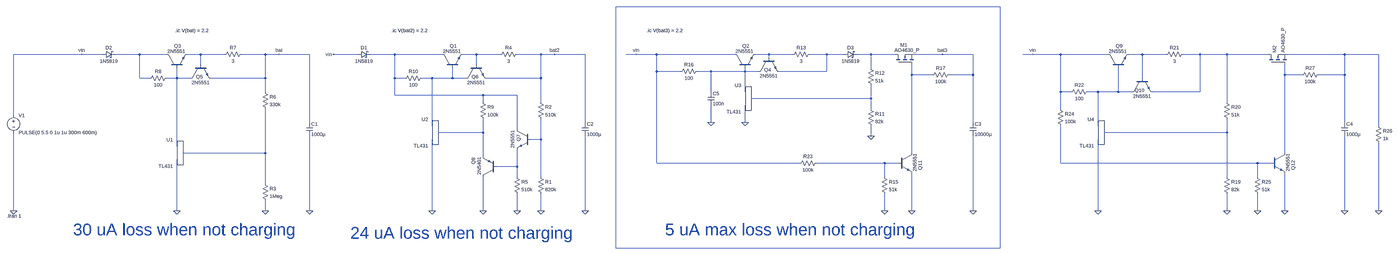
[diagram p0: schematic discrete_charger_TL431.asc, whole sheet]
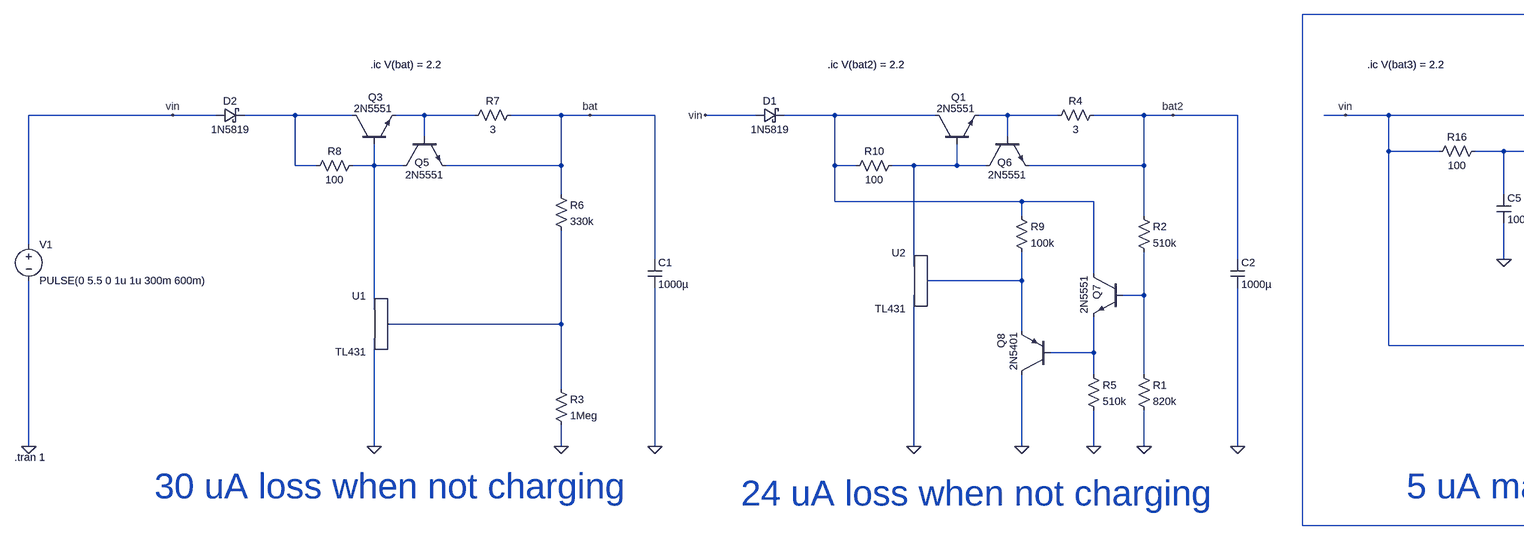
[diagram p1: schematic discrete_charger_TL431.asc, part, row 1 of 1, column 1 of 2]
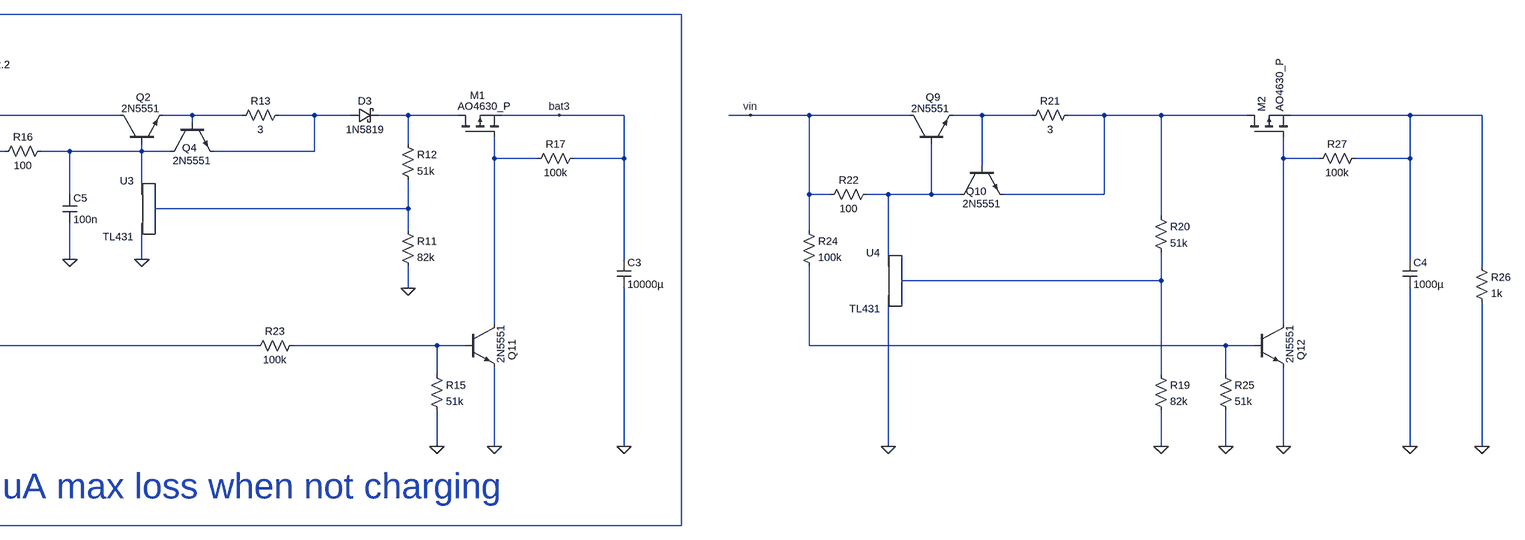
[diagram p2: schematic discrete_charger_TL431.asc, part, row 1 of 1, column 2 of 2]
discrete_charger_TL431.asc, the LTspice schematic file:
Version 4
SHEET 1 6228 756
WIRE 4224 -384 2416 -384
WIRE -96 -160 -416 -160
WIRE 0 -160 -96 -160
WIRE 176 -160 64 -160
WIRE 304 -160 176 -160
WIRE 464 -160 400 -160
WIRE 576 -160 464 -160
WIRE 768 -160 656 -160
WIRE 832 -160 768 -160
WIRE 976 -160 832 -160
WIRE 1200 -160 1088 -160
WIRE 1376 -160 1264 -160
WIRE 1600 -160 1376 -160
WIRE 1760 -160 1696 -160
WIRE 1872 -160 1760 -160
WIRE 2064 -160 1952 -160
WIRE 2128 -160 2064 -160
WIRE 2272 -160 2128 -160
WIRE 2512 -160 2464 -160
WIRE 2608 -160 2512 -160
WIRE 2976 -160 2608 -160
WIRE 3136 -160 3072 -160
WIRE 3248 -160 3136 -160
WIRE 3408 -160 3328 -160
WIRE 3488 -160 3408 -160
WIRE 3616 -160 3552 -160
WIRE 3728 -160 3616 -160
WIRE 3952 -160 3824 -160
WIRE 4096 -160 3952 -160
WIRE 4432 -160 4384 -160
WIRE 4656 -160 4432 -160
WIRE 4880 -160 4656 -160
WIRE 5040 -160 4976 -160
WIRE 5152 -160 5040 -160
WIRE 5312 -160 5232 -160
WIRE 5440 -160 5312 -160
WIRE 5632 -160 5440 -160
WIRE 6000 -160 5728 -160
WIRE 6160 -160 6000 -160
WIRE 3136 -144 3136 -160
WIRE 464 -112 464 -160
WIRE 1760 -112 1760 -160
WIRE 3616 -96 3616 -160
WIRE 2608 -80 2608 -160
WIRE 2720 -80 2608 -80
WIRE 2864 -80 2800 -80
WIRE 3024 -80 3024 -96
WIRE 3024 -80 2864 -80
WIRE 3088 -80 3024 -80
WIRE 3408 -80 3408 -160
WIRE 3408 -80 3184 -80
WIRE 3808 -64 3808 -112
WIRE 3904 -64 3808 -64
WIRE 4096 -64 4096 -160
WIRE 4096 -64 3984 -64
WIRE 5712 -64 5712 -112
WIRE 5792 -64 5712 -64
WIRE 6000 -64 6000 -160
WIRE 6000 -64 5872 -64
WIRE 176 -48 176 -160
WIRE 224 -48 176 -48
WIRE 352 -48 352 -96
WIRE 352 -48 304 -48
WIRE 416 -48 352 -48
WIRE 768 -48 768 -160
WIRE 768 -48 512 -48
WIRE 1376 -48 1376 -160
WIRE 1424 -48 1376 -48
WIRE 1552 -48 1504 -48
WIRE 1648 -48 1648 -96
WIRE 1648 -48 1552 -48
WIRE 1712 -48 1648 -48
WIRE 2064 -48 2064 -160
WIRE 2064 -48 1808 -48
WIRE 5040 -48 5040 -160
WIRE 768 16 768 -48
WIRE 2864 16 2864 -80
WIRE 3024 16 3024 -80
WIRE 4656 16 4656 -160
WIRE 4704 16 4656 16
WIRE 4832 16 4784 16
WIRE 4928 16 4928 -96
WIRE 4928 16 4832 16
WIRE 4992 16 4928 16
WIRE 5312 16 5312 -160
WIRE 5312 16 5088 16
WIRE 1376 32 1376 -48
WIRE 1792 32 1376 32
WIRE 1952 32 1792 32
WIRE 3616 48 3616 -16
WIRE 3616 48 3056 48
WIRE 1792 64 1792 32
WIRE 2064 64 2064 -48
WIRE 5440 64 5440 -160
WIRE 3616 96 3616 48
WIRE 4656 96 4656 16
WIRE -416 128 -416 -160
WIRE 976 160 976 -160
WIRE 2272 160 2272 -160
WIRE 2864 160 2864 80
WIRE 3024 160 3024 80
WIRE 4096 160 4096 -64
WIRE 6000 160 6000 -64
WIRE 1552 176 1552 -48
WIRE 4832 176 4832 16
WIRE 6160 176 6160 -160
WIRE 1952 192 1952 32
WIRE 1792 208 1792 144
WIRE 1792 208 1584 208
WIRE 5440 208 5440 144
WIRE 5440 208 4864 208
WIRE 3616 224 3616 176
WIRE 2064 240 2064 144
WIRE 2064 240 2016 240
WIRE 352 272 352 -48
WIRE 768 304 768 96
WIRE 768 304 384 304
WIRE 3808 304 3808 -64
WIRE 5712 304 5712 -64
WIRE 1792 320 1792 208
WIRE 2608 352 2608 -80
WIRE 3280 352 2608 352
WIRE 3680 352 3360 352
WIRE 3744 352 3680 352
WIRE 4656 352 4656 176
WIRE 5584 352 4656 352
WIRE 5648 352 5584 352
WIRE 1952 368 1952 288
WIRE 1952 368 1856 368
WIRE 1952 416 1952 368
WIRE 2064 416 2064 240
WIRE 3680 416 3680 352
WIRE 5440 416 5440 208
WIRE 5584 416 5584 352
WIRE 768 448 768 304
WIRE -416 576 -416 208
WIRE 352 576 352 336
WIRE 768 576 768 528
WIRE 976 576 976 224
WIRE 1552 576 1552 240
WIRE 1792 576 1792 416
WIRE 1952 576 1952 496
WIRE 2064 576 2064 496
WIRE 2272 576 2272 224
WIRE 3680 576 3680 496
WIRE 3808 576 3808 400
WIRE 4096 576 4096 224
WIRE 4832 576 4832 240
WIRE 5440 576 5440 496
WIRE 5584 576 5584 496
WIRE 5712 576 5712 400
WIRE 6000 576 6000 224
WIRE 6160 576 6160 256
WIRE 2416 752 2416 -384
WIRE 4224 752 4224 -384
WIRE 4224 752 2416 752
FLAG 768 576 0
FLAG 976 576 0
FLAG -416 576 0
FLAG 832 -160 bat
FLAG 352 576 0
FLAG -96 -160 vin
FLAG 2064 576 0
FLAG 2272 576 0
FLAG 2128 -160 bat2
FLAG 1552 576 0
FLAG 1088 -160 vin
FLAG 1952 576 0
FLAG 1792 576 0
FLAG 3616 224 0
FLAG 4096 576 0
FLAG 3952 -160 bat3
FLAG 3024 160 0
FLAG 2512 -160 vin
FLAG 3680 576 0
FLAG 3808 576 0
FLAG 5440 576 0
FLAG 6000 576 0
FLAG 4832 576 0
FLAG 4432 -160 vin
FLAG 5584 576 0
FLAG 5712 576 0
FLAG 6160 576 0
FLAG 2864 160 0
SYMBOL res 752 432 R0
SYMATTR InstName R3
SYMATTR Value 1Meg
SYMBOL npn 304 -96 R270
WINDOW 0 104 35 VRight 2
WINDOW 3 79 3 VRight 2
SYMATTR InstName Q3
SYMATTR Value 2N5551
SYMBOL res 752 0 R0
SYMATTR InstName R6
SYMATTR Value 330k
SYMBOL voltage -416 112 R0
WINDOW 123 0 0 Left 0
WINDOW 39 0 0 Left 0
SYMATTR InstName V1
SYMATTR Value PULSE(0 5.5 0 1u 1u 300m 600m)
SYMBOL cap 960 160 R0
SYMATTR InstName C1
SYMATTR Value 1000µ
SYMBOL res 560 -144 R270
WINDOW 0 32 56 VTop 2
WINDOW 3 0 56 VBottom 2
SYMATTR InstName R7
SYMATTR Value 3
SYMBOL npn 416 -112 M90
WINDOW 0 57 58 VLeft 2
WINDOW 3 85 90 VLeft 2
SYMATTR InstName Q5
SYMATTR Value 2N5551
SYMBOL ZZZ\\REF\\TL431 368 272 M0
SYMATTR InstName U1
SYMBOL res 2048 400 R0
SYMATTR InstName R1
SYMATTR Value 820k
SYMBOL npn 1600 -96 R270
WINDOW 0 104 35 VRight 2
WINDOW 3 79 3 VRight 2
SYMATTR InstName Q1
SYMATTR Value 2N5551
SYMBOL res 2048 48 R0
SYMATTR InstName R2
SYMATTR Value 510k
SYMBOL cap 2256 160 R0
SYMATTR InstName C2
SYMATTR Value 1000µ
SYMBOL res 1856 -144 R270
WINDOW 0 32 56 VTop 2
WINDOW 3 0 56 VBottom 2
SYMATTR InstName R4
SYMATTR Value 3
SYMBOL npn 1712 -112 M90
WINDOW 0 57 58 VLeft 2
WINDOW 3 85 90 VLeft 2
SYMATTR InstName Q6
SYMATTR Value 2N5551
SYMBOL ZZZ\\REF\\TL431 1568 176 M0
SYMATTR InstName U2
SYMBOL npn 2016 192 M0
WINDOW 0 57 58 VLeft 2
WINDOW 3 85 90 VLeft 2
SYMATTR InstName Q7
SYMATTR Value 2N5551
SYMBOL res 1936 400 R0
SYMATTR InstName R5
SYMATTR Value 510k
SYMBOL pnp 1856 416 R180
WINDOW 0 109 90 VLeft 2
WINDOW 3 82 93 VLeft 2
SYMATTR InstName Q8
SYMATTR Value 2N5401
SYMBOL res 1776 48 R0
SYMATTR InstName R9
SYMATTR Value 100k
SYMBOL res 1520 -64 R90
WINDOW 0 0 56 VBottom 2
WINDOW 3 32 56 VTop 2
SYMATTR InstName R10
SYMATTR Value 100
SYMBOL res 320 -64 R90
WINDOW 0 0 56 VBottom 2
WINDOW 3 32 56 VTop 2
SYMATTR InstName R8
SYMATTR Value 100
SYMBOL res 3600 80 R0
SYMATTR InstName R11
SYMATTR Value 82k
SYMBOL npn 2976 -96 R270
WINDOW 0 104 35 VRight 2
WINDOW 3 79 3 VRight 2
SYMATTR InstName Q2
SYMATTR Value 2N5551
SYMBOL res 3600 -112 R0
SYMATTR InstName R12
SYMATTR Value 51k
SYMBOL cap 4080 160 R0
SYMATTR InstName C3
SYMATTR Value 10000µ
SYMBOL res 3232 -144 R270
WINDOW 0 32 56 VTop 2
WINDOW 3 0 56 VBottom 2
SYMATTR InstName R13
SYMATTR Value 3
SYMBOL npn 3088 -144 M90
WINDOW 0 57 58 VLeft 2
WINDOW 3 85 90 VLeft 2
SYMATTR InstName Q4
SYMATTR Value 2N5551
SYMBOL ZZZ\\REF\\TL431 3040 16 M0
SYMATTR InstName U3
SYMBOL res 2816 -96 R90
WINDOW 0 0 56 VBottom 2
WINDOW 3 32 56 VTop 2
SYMATTR InstName R16
SYMATTR Value 100
SYMBOL pmos 3728 -112 R270
WINDOW 0 92 26 VRight 2
WINDOW 3 68 -2 VRight 2
SYMATTR InstName M1
SYMATTR Value AO4630_P
SYMBOL res 4000 -80 R90
WINDOW 0 0 56 VBottom 2
WINDOW 3 32 56 VTop 2
SYMATTR InstName R17
SYMATTR Value 100k
SYMBOL npn 3744 304 R0
WINDOW 0 104 35 VRight 2
WINDOW 3 79 3 VRight 2
SYMATTR InstName Q11
SYMATTR Value 2N5551
SYMBOL res 3664 400 R0
SYMATTR InstName R15
SYMATTR Value 51k
SYMBOL schottky 0 -144 R270
WINDOW 0 32 32 VTop 2
WINDOW 3 0 32 VBottom 2
SYMATTR InstName D2
SYMATTR Value 1N5819
SYMATTR Description Diode
SYMATTR Type diode
SYMBOL schottky 1200 -144 R270
WINDOW 0 32 32 VTop 2
WINDOW 3 0 32 VBottom 2
SYMATTR InstName D1
SYMATTR Value 1N5819
SYMATTR Description Diode
SYMATTR Type diode
SYMBOL schottky 3488 -144 R270
WINDOW 0 32 32 VTop 2
WINDOW 3 0 32 VBottom 2
SYMATTR InstName D3
SYMATTR Value 1N5819
SYMATTR Description Diode
SYMATTR Type diode
SYMBOL res 5424 400 R0
SYMATTR InstName R19
SYMATTR Value 82k
SYMBOL npn 4880 -96 R270
WINDOW 0 104 35 VRight 2
WINDOW 3 79 3 VRight 2
SYMATTR InstName Q9
SYMATTR Value 2N5551
SYMBOL res 5424 48 R0
SYMATTR InstName R20
SYMATTR Value 51k
SYMBOL cap 5984 160 R0
SYMATTR InstName C4
SYMATTR Value 1000µ
SYMBOL res 5136 -144 R270
WINDOW 0 32 56 VTop 2
WINDOW 3 0 56 VBottom 2
SYMATTR InstName R21
SYMATTR Value 3
SYMBOL npn 4992 -48 M90
WINDOW 0 57 58 VLeft 2
WINDOW 3 85 90 VLeft 2
SYMATTR InstName Q10
SYMATTR Value 2N5551
SYMBOL ZZZ\\REF\\TL431 4848 176 M0
SYMATTR InstName U4
SYMBOL res 4800 0 R90
WINDOW 0 0 56 VBottom 2
WINDOW 3 32 56 VTop 2
SYMATTR InstName R22
SYMATTR Value 100
SYMBOL pmos 5632 -112 R270
SYMATTR InstName M2
SYMATTR Value AO4630_P
SYMBOL npn 5648 304 R0
WINDOW 0 104 35 VRight 2
WINDOW 3 79 3 VRight 2
SYMATTR InstName Q12
SYMATTR Value 2N5551
SYMBOL res 4640 80 R0
SYMATTR InstName R24
SYMATTR Value 100k
SYMBOL res 5568 400 R0
SYMATTR InstName R25
SYMATTR Value 51k
SYMBOL res 6144 160 R0
SYMATTR InstName R26
SYMATTR Value 1k
SYMBOL res 5888 -80 R90
WINDOW 0 0 56 VBottom 2
WINDOW 3 32 56 VTop 2
SYMATTR InstName R27
SYMATTR Value 100k
SYMBOL res 3376 336 R90
WINDOW 0 0 56 VBottom 2
WINDOW 3 32 56 VTop 2
SYMATTR InstName R23
SYMATTR Value 100k
SYMBOL cap 2848 16 R0
SYMATTR InstName C5
SYMATTR Value 100n
TEXT -448 600 Left 2 !.tran 1
TEXT 1360 -272 Left 2 !.ic V(bat2) = 2.2
TEXT 344 -272 Left 2 !.ic V(bat) = 2.2
TEXT 2560 -272 Left 2 !.ic V(bat3) = 2.2
TEXT -136 664 Left 6 ;30 uA loss when not charging
TEXT 1168 680 Left 6 ;24 uA loss when not charging
TEXT 2648 664 Left 6 ;5 uA max loss when not charging

The netlist it stands for:
* discrete_charger_TL431.asc
R3 N022 0 1Meg
Q3 N002 N015 N003 0 2N5551
R6 bat N022 330k
V1 vin 0 PULSE(0 5.5 0 1u 1u 300m 600m)
C1 bat 0 1000µ
R7 N003 bat 3
Q5 N015 N003 bat 0 2N5551
XU1 N022 0 N015 TL431
R1 N021 0 820k
Q1 N004 N016 N005 0 2N5551
R2 bat2 N021 510k
C2 bat2 0 1000µ
R4 N005 bat2 3
Q6 N016 N005 bat2 0 2N5551
XU2 N019 0 N016 TL431
Q7 N004 N021 N025 0 2N5551
R5 N025 0 510k
Q8 0 N025 N019 0 2N5401
R9 N004 N019 100k
R10 N016 N004 100
R8 N015 N002 100
R11 N018 0 82k
Q2 vin N012 N006 0 2N5551
R12 N008 N018 51k
C3 bat3 0 10000µ
R13 N006 N007 3
Q4 N012 N006 N007 0 2N5551
XU3 N018 0 N012 TL431
R16 N012 vin 100
M1 N008 N013 bat3 bat3 AO4630_P
R17 bat3 N013 100k
Q11 N013 N023 0 0 2N5551
R15 N023 0 51k
D2 vin N002 1N5819
D1 vin N004 1N5819
D3 N007 N008 1N5819
R19 N020 0 82k
Q9 vin N017 N009 0 2N5551
R20 N010 N020 51k
C4 N011 0 1000µ
R21 N009 N010 3
Q10 N017 N009 N010 0 2N5551
XU4 N020 0 N017 TL431
R22 N017 vin 100
M2 N010 N014 N011 N011 AO4630_P
Q12 N014 N024 0 0 2N5551
R24 vin N024 100k
R25 N024 0 51k
R26 N011 0 1k
R27 N011 N014 100k
R23 N023 vin 100k
C5 N012 0 100n
.model D D
.lib standard.dio
.model NPN NPN
.model PNP PNP
.lib standard.bjt
.model NMOS NMOS
.model PMOS PMOS
.lib standard.mos
.tran 1
.ic V(bat2) = 2.2
.ic V(bat) = 2.2
.ic V(bat3) = 2.2
* 30 uA loss when not charging
* 24 uA loss when not charging
* 5 uA max loss when not charging
.lib TL431.mod
.backanno
.end